# EAGLE design Game of Chairs (EAGLE 6.5.0)
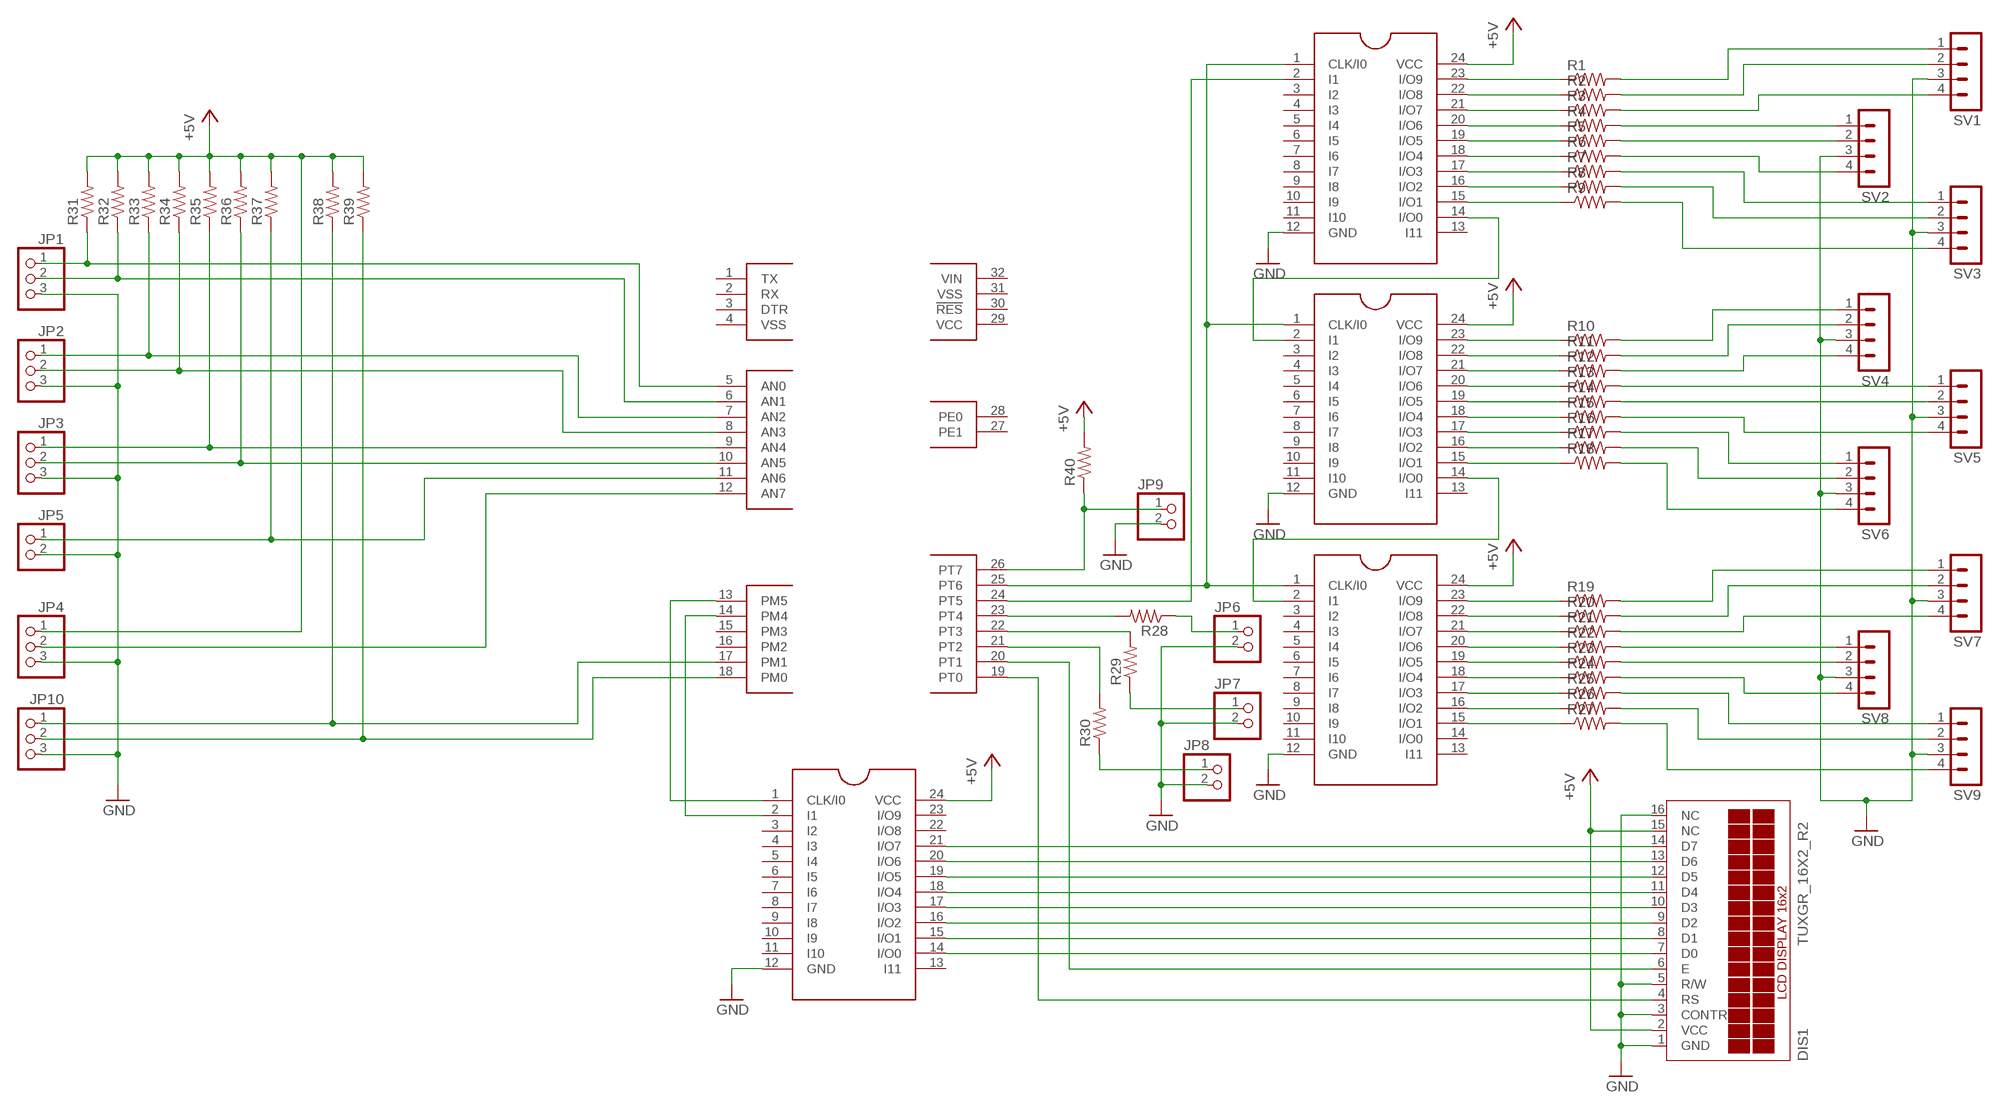
[diagram p0: schematic, sheet 1]

## Parts
DIS1  TUXGR_16X2_R2  [TUXGR_16X2_R2]
GAL1  GAL  [DIL20]
GAL2  GAL  [DIL20]
GAL3  GAL  [DIL20]
GAL4  GAL  [DIL20]
JP1  PINHD-1X3  [1X03]
JP2  PINHD-1X3  [1X03]
JP3  PINHD-1X3  [1X03]
JP4  PINHD-1X3  [1X03]
JP5  PINHD-1X2  [1X02]
JP6  PINHD-1X2  [1X02]
JP7  PINHD-1X2  [1X02]
JP8  PINHD-1X2  [1X02]
JP9  PINHD-1X2  [1X02]
JP10  PINHD-1X3  [1X03]
R1  R-US_0207/12  [0207/12]
R2  R-US_0207/12  [0207/12]
R3  R-US_0207/12  [0207/12]
R4  R-US_0207/12  [0207/12]
R5  R-US_0207/12  [0207/12]
R6  R-US_0207/12  [0207/12]
R7  R-US_0207/12  [0207/12]
R8  R-US_0207/12  [0207/12]
R9  R-US_0207/12  [0207/12]
R10  R-US_0207/12  [0207/12]
R11  R-US_0207/12  [0207/12]
R12  R-US_0207/12  [0207/12]
R13  R-US_0207/12  [0207/12]
R14  R-US_0207/12  [0207/12]
R15  R-US_0207/12  [0207/12]
R16  R-US_0207/12  [0207/12]
R17  R-US_0207/12  [0207/12]
R18  R-US_0207/12  [0207/12]
R19  R-US_0207/12  [0207/12]
R20  R-US_0207/12  [0207/12]
R21  R-US_0207/12  [0207/12]
R22  R-US_0207/12  [0207/12]
R23  R-US_0207/12  [0207/12]
R24  R-US_0207/12  [0207/12]
R25  R-US_0207/12  [0207/12]
R26  R-US_0207/12  [0207/12]
R27  R-US_0207/12  [0207/12]
R28  R-US_0207/12  [0207/12]
R29  R-US_0207/12  [0207/12]
R30  R-US_0207/12  [0207/12]
R31  R-US_0207/12  [0207/12]
R32  R-US_0207/12  [0207/12]
R33  R-US_0207/12  [0207/12]
R34  R-US_0207/12  [0207/12]
R35  R-US_0207/12  [0207/12]
R36  R-US_0207/12  [0207/12]
R37  R-US_0207/12  [0207/12]
R38  R-US_0207/12  [0207/12]
R39  R-US_0207/12  [0207/12]
R40  R-US_0207/12  [0207/12]
SV1  MA04-1  [MA04-1]
SV2  MA04-1  [MA04-1]
SV3  MA04-1  [MA04-1]
SV4  MA04-1  [MA04-1]
SV5  MA04-1  [MA04-1]
SV6  MA04-1  [MA04-1]
SV7  MA04-1  [MA04-1]
SV8  MA04-1  [MA04-1]
SV9  MA04-1  [MA04-1]
U1  362MICRO362MICRO  [40P]

## Nets
+5V: DIS1.2(VCC) DIS1.15(NC) GAL1.24(VCC) GAL2.24(VCC) GAL3.24(VCC) GAL4.24(VCC) JP4.1 R31.2 R32.2 R33.2 R34.2 R35.2 R36.2 R37.2 R38.2 R39.2 R40.2
GND: DIS1.1(GND) DIS1.3(CONTR) DIS1.5(R/W) DIS1.16(NC) GAL1.12(GND) GAL2.12(GND) GAL3.12(GND) GAL4.12(GND) JP1.3 JP2.3 JP3.3 JP4.3 JP5.2 JP6.2 JP7.2 JP8.2 JP9.2 JP10.3 SV1.3 SV2.3 SV3.3 SV4.3 SV5.3 SV6.3 SV7.3 SV8.3 SV9.3
N$1: R1.2 SV1.1
N$2: R2.2 SV1.2
N$3: R3.2 SV1.4
N$4: GAL1.23(I/O9) R1.1
N$5: GAL1.22(I/O8) R2.1
N$6: R6.2 SV2.4
N$7: R7.2 SV3.1
N$8: R8.2 SV3.2
N$9: R9.2 SV3.4
N$10: R10.2 SV4.1
N$11: R11.2 SV4.2
N$12: R12.2 SV4.4
N$13: GAL1.21(I/O7) R3.1
N$14: GAL1.20(I/O6) R4.1
N$15: R15.2 SV5.4
N$16: R16.2 SV6.1
N$17: R17.2 SV6.2
N$18: R18.2 SV6.4
N$19: GAL1.14(I/O0) GAL2.2(I1)
N$20: GAL2.14(I/O0) GAL3.2(I1)
N$21: R19.2 SV7.1
N$22: R20.2 SV7.2
N$23: R21.2 SV7.4
N$24: R4.2 SV2.1
N$25: GAL1.19(I/O5) R5.1
N$26: R24.2 SV8.4
N$27: R25.2 SV9.1
N$28: R26.2 SV9.2
N$29: R27.2 SV9.4
N$30: GAL1.1(CLK/I0) GAL2.1(CLK/I0) GAL3.1(CLK/I0) U1.25(PT6)
N$31: GAL1.2(I1) U1.24(PT5)
N$32: GAL4.1(CLK/I0) U1.13(PM5)
N$33: GAL4.2(I1) U1.14(PM4)
N$34: R5.2 SV2.2
N$35: GAL1.18(I/O4) R6.1
N$36: GAL1.17(I/O3) R7.1
N$37: GAL1.16(I/O2) R8.1
N$38: GAL1.15(I/O1) R9.1
N$39: GAL2.23(I/O9) R10.1
N$40: GAL2.22(I/O8) R11.1
N$41: GAL2.21(I/O7) R12.1
N$42: GAL2.20(I/O6) R13.1
N$43: GAL2.19(I/O5) R14.1
N$44: GAL2.18(I/O4) R15.1
N$45: GAL2.17(I/O3) R16.1
N$46: GAL2.16(I/O2) R17.1
N$47: GAL2.15(I/O1) R18.1
N$48: R14.2 SV5.2
N$49: R13.2 SV5.1
N$50: GAL3.23(I/O9) R19.1
N$51: GAL3.22(I/O8) R20.1
N$52: GAL3.21(I/O7) R21.1
N$53: GAL3.20(I/O6) R22.1
N$54: GAL3.19(I/O5) R23.1
N$55: GAL3.18(I/O4) R24.1
N$56: GAL3.17(I/O3) R25.1
N$57: GAL3.16(I/O2) R26.1
N$58: GAL3.15(I/O1) R27.1
N$59: R23.2 SV8.2
N$60: R22.2 SV8.1
N$61: JP1.1 R31.1 U1.5(AN0)
N$62: JP1.2 R32.1 U1.6(AN1)
N$63: JP2.1 R33.1 U1.7(AN2)
N$64: JP2.2 R34.1 U1.8(AN3)
N$65: JP3.1 R35.1 U1.9(AN4)
N$66: JP3.2 R36.1 U1.10(AN5)
N$67: JP5.1 R37.1 U1.11(AN6)
N$68: JP9.1 R40.1 U1.26(PT7)
N$69: JP10.1 R38.1 U1.17(PM1)
N$70: JP10.2 R39.1 U1.18(PM0)
N$71: JP4.2 U1.12(AN7)
N$72: R28.2 U1.23(PT4)
N$73: JP6.1 R28.1
N$74: R29.2 U1.22(PT3)
N$75: R30.2 U1.21(PT2)
N$76: JP7.1 R29.1
N$77: JP8.1 R30.1
N$78: DIS1.6(E) U1.20(PT1)
N$79: DIS1.4(RS) U1.19(PT0)
N$80: DIS1.7(D0) GAL4.14(I/O0)
N$81: DIS1.8(D1) GAL4.15(I/O1)
N$82: DIS1.9(D2) GAL4.16(I/O2)
N$83: DIS1.10(D3) GAL4.17(I/O3)
N$84: DIS1.11(D4) GAL4.18(I/O4)
N$85: DIS1.12(D5) GAL4.19(I/O5)
N$86: DIS1.13(D6) GAL4.20(I/O6)
N$87: DIS1.14(D7) GAL4.21(I/O7)
Unconnected: GAL1.3(I2) GAL1.4(I3) GAL1.5(I4) GAL1.6(I5) GAL1.7(I6) GAL1.8(I7) GAL1.9(I8) GAL1.10(I9) GAL1.11(I10) GAL1.13(I11) GAL2.3(I2) GAL2.4(I3) GAL2.5(I4) GAL2.6(I5) GAL2.7(I6) GAL2.8(I7) GAL2.9(I8) GAL2.10(I9) GAL2.11(I10) GAL2.13(I11) GAL3.3(I2) GAL3.4(I3) GAL3.5(I4) GAL3.6(I5) GAL3.7(I6) GAL3.8(I7) GAL3.9(I8) GAL3.10(I9) GAL3.11(I10) GAL3.13(I11) GAL3.14(I/O0) GAL4.3(I2) GAL4.4(I3) GAL4.5(I4) GAL4.6(I5) GAL4.7(I6) GAL4.8(I7) GAL4.9(I8) GAL4.10(I9) GAL4.11(I10) GAL4.13(I11) GAL4.22(I/O8) GAL4.23(I/O9) U1.1(TX) U1.2(RX) U1.3(DTR) U1.4(VSS) U1.15(PM3) U1.16(PM2) U1.27(PE1) U1.28(PE0) U1.29(VCC) U1.30(!RES) U1.31(VSS) U1.32(VIN)

## Library data of the parts
DIS1 = display-lcd:TUXGR_16X2_R2: Tuxgraphics LCD display 16x2 characters reflective, without background light Source: tuxgr_12x2_r2.pdf; OC_FARNELL: unknown; OC_NEWARK: unknown
GAL1-GAL4 = 362 parts:GAL
JP1-JP4 JP10 = pinhead:PINHD-1X3: PIN HEADER
JP5-JP9 = pinhead:PINHD-1X2: PIN HEADER
R1-R40 = resistor:R-US_: RESISTOR, American symbol
SV1-SV9 = con-lstb:MA04-1: PIN HEADER; OC_FARNELL: unknown; OC_NEWARK: unknown
U1 = 362 parts:362MICRO

## Board
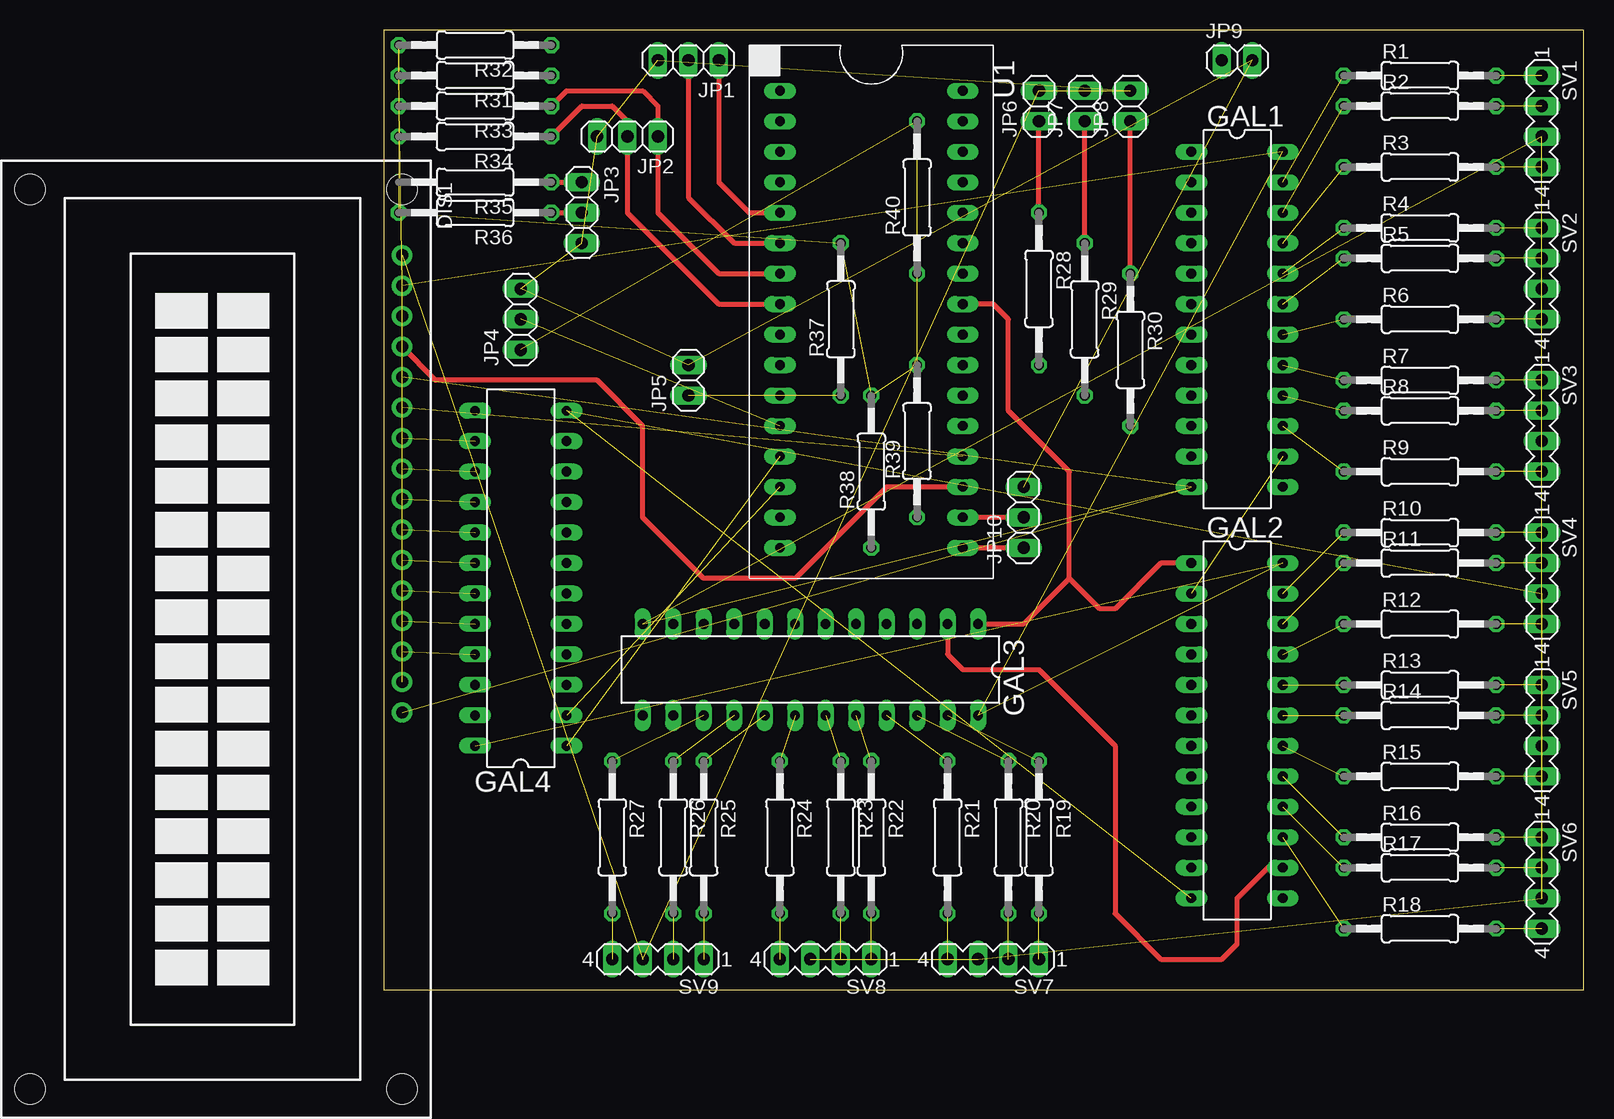
[diagram p1: board, top side]
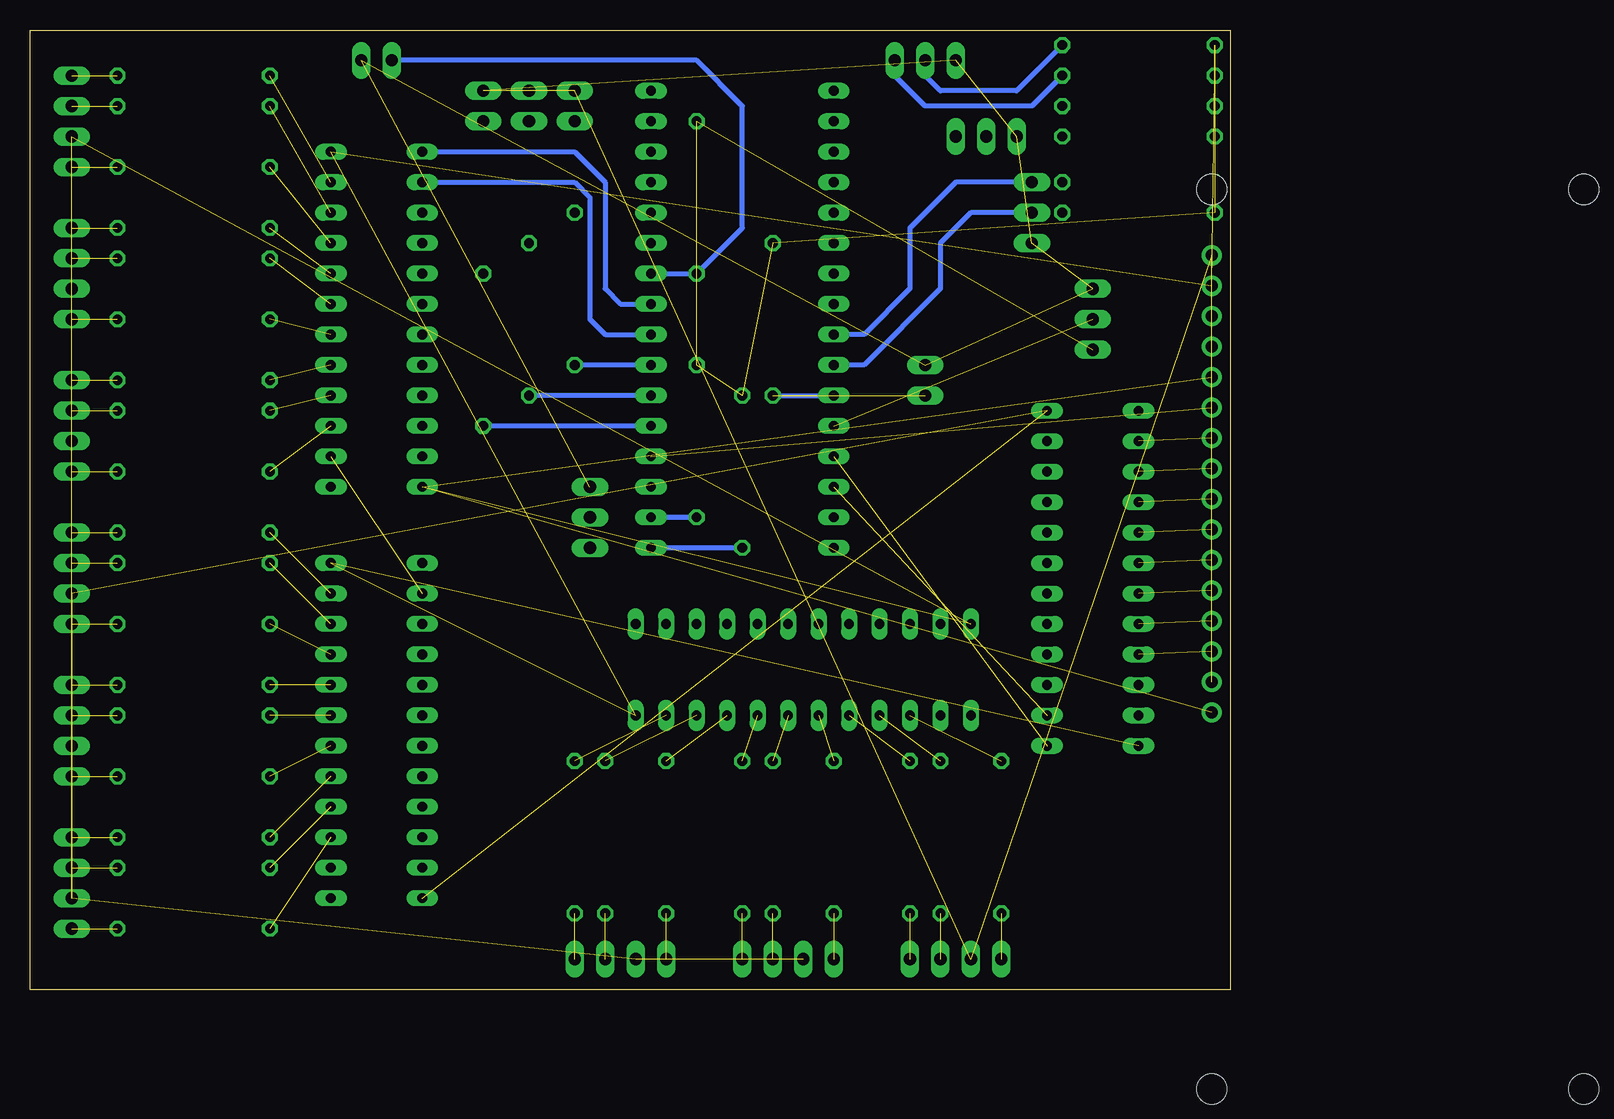
[diagram p2: board, bottom side, seen from below]

Size 100 x 80 mm. Coordinates in mm from the lower left corner, seen from the top.
Outline: 0,0 100,0 100,80 0,80 0,0
Copper layers (1*16): Top 0.035mm / dielectric 1.5mm / Bottom 0.035mm
Design rules "default": minimum track width 10mil, minimum drill 24mil, track to track 8mil, track to pad 8mil, pad to pad 8mil, via to via 8mil, smd to smd 8mil, copper to edge 40mil, drill to drill 8mil, minimum pad ring 10mil, minimum via ring 8mil, stop-mask expansion 4mil, vias tented up to drill 0mil, thermal gap 10mil

### Footprints (pad centres in the part's own frame; a part is rotated, then mirrored left to right if it is on the bottom)
TUXGR_16X2_R2 = drill 1 pad 1.676: 1 -32,15.5; 2 -29.46,15.5; 3 -26.92,15.5; 4 -24.38,15.5; 5 -21.84,15.5; 6 -19.3,15.5; 7 -16.76,15.5; 8 -14.22,15.5; 9 -11.68,15.5; 10 -9.14,15.5; 11 -6.6,15.5; 12 -4.06,15.5; 13 -1.52,15.5; 14 1.02,15.5; 15 3.56,15.5; 16 6.1,15.5 | hole 2.5: -37.5,-15.5; 37.5,-15.5; -37.5,15.5; 37.5,15.5
DIL20 = drill 0.813 long: 1 -11.43,-3.81; 2 -8.89,-3.81; 3 -6.35,-3.81; 4 -3.81,-3.81; 5 -1.27,-3.81; 6 1.27,-3.81; 7 3.81,-3.81; 8 6.35,-3.81; 9 8.89,-3.81; 10 11.43,-3.81; 11 13.97,-3.81; 12 16.51,-3.81; 13 16.51,3.81; 14 13.97,3.81; 15 11.43,3.81; 16 8.89,3.81; 17 6.35,3.81; 18 3.81,3.81; 19 1.27,3.81; 20 -1.27,3.81; 21 -3.81,3.81; 22 -6.35,3.81; 23 -8.89,3.81; 24 -11.43,3.81
1X03 = drill 1.016 long: 1 -2.54,0; 2 0,0; 3 2.54,0
1X02 = drill 1.016 long: 1 -1.27,0; 2 1.27,0
0207/12 = drill 0.813 octagon: 1 -6.35,0; 2 6.35,0
MA04-1 = drill 1.016 long: 1 -3.81,0; 2 -1.27,0; 3 1.27,0; 4 3.81,0
40P = drill 0.813 long: 1 -24.13,-7.62; 2 -21.59,-7.62; 3 -19.05,-7.62; 4 -16.51,-7.62; 5 -13.97,-7.62; 6 -11.43,-7.62; 7 -8.89,-7.62; 8 -6.35,-7.62; 9 -3.81,-7.62; 10 -1.27,-7.62; 11 1.27,-7.62; 12 3.81,-7.62; 13 6.35,-7.62; 14 8.89,-7.62; 15 11.43,-7.62; 16 13.97,-7.62; 17 13.97,7.62; 18 11.43,7.62; 19 8.89,7.62; 20 6.35,7.62; 21 3.81,7.62; 22 1.27,7.62; 23 -1.27,7.62; 24 -3.81,7.62; 25 -6.35,7.62; 26 -8.89,7.62; 27 -11.43,7.62; 28 -13.97,7.62; 29 -16.51,7.62; 30 -19.05,7.62; 31 -21.59,7.62; 32 -24.13,7.62

### Placement (x,y rotation side)
DIS1  -13.97,29.21 270 top
GAL1  71.12,58.42 270 top
GAL2  71.12,24.13 270 top
GAL3  38.1,26.67 180 top
GAL4  11.43,31.75 90 top
JP1  25.4,77.47 180 top
JP2  20.32,71.12 180 top
JP3  16.51,64.77 270 top
JP4  11.43,55.88 90 top
JP5  25.4,50.8 90 top
JP6  54.61,73.66 90 top
JP7  58.42,73.66 90 top
JP8  62.23,73.66 90 top
JP9  71.12,77.47 0 top
JP10  53.34,39.37 90 top
R1  86.36,76.2 0 top
R2  86.36,73.66 0 top
R3  86.36,68.58 0 top
R4  86.36,63.5 0 top
R5  86.36,60.96 0 top
R6  86.36,55.88 0 top
R7  86.36,50.8 0 top
R8  86.36,48.26 0 top
R9  86.36,43.18 0 top
R10  86.36,38.1 0 top
R11  86.36,35.56 0 top
R12  86.36,30.48 0 top
R13  86.36,25.4 0 top
R14  86.36,22.86 0 top
R15  86.36,17.78 0 top
R16  86.36,12.7 0 top
R17  86.36,10.16 0 top
R18  86.36,5.08 0 top
R19  54.61,12.7 270 top
R20  52.07,12.7 270 top
R21  46.99,12.7 270 top
R22  40.64,12.7 270 top
R23  38.1,12.7 270 top
R24  33.02,12.7 270 top
R25  26.67,12.7 270 top
R26  24.13,12.7 270 top
R27  19.05,12.7 270 top
R28  54.61,58.42 270 top
R29  58.42,55.88 270 top
R30  62.23,53.34 270 top
R31  7.62,76.2 180 top
R32  7.62,78.74 180 top
R33  7.62,73.66 180 top
R34  7.62,71.12 180 top
R35  7.62,67.31 180 top
R36  7.62,64.77 180 top
R37  38.1,55.88 90 top
R38  40.64,43.18 90 top
R39  44.45,45.72 90 top
R40  44.45,66.04 90 top
SV1  96.52,72.39 270 top
SV2  96.52,59.69 270 top
SV3  96.52,46.99 270 top
SV4  96.52,34.29 270 top
SV5  96.52,21.59 270 top
SV6  96.52,8.89 270 top
SV7  50.8,2.54 180 top
SV8  36.83,2.54 180 top
SV9  22.86,2.54 180 top
U1  40.64,50.8 270 top

### Tracks (layer width: path | path; a pad name or v marks a point on that pad's centre or on a via)
+5V  (16 unrouted)
GND  (26 unrouted)
N$1  (1 unrouted)
N$2  (1 unrouted)
N$3  (1 unrouted)
N$4  (1 unrouted)
N$5  (1 unrouted)
N$6  (1 unrouted)
N$7  (1 unrouted)
N$8  (1 unrouted)
N$9  (1 unrouted)
N$10  (1 unrouted)
N$11  (1 unrouted)
N$12  (1 unrouted)
N$13  (1 unrouted)
N$14  (1 unrouted)
N$15  (1 unrouted)
N$16  (1 unrouted)
N$17  (1 unrouted)
N$18  (1 unrouted)
N$19  (1 unrouted)
N$20
  Top 0.406: GAL3.2 46.99,27.94 48.26,26.67 54.61,26.67 60.96,20.32 60.96,6.35 64.77,2.54 69.85,2.54 71.12,3.81 71.12,7.62 73.66,10.16 GAL2.14
N$21  (1 unrouted)
N$22  (1 unrouted)
N$23  (1 unrouted)
N$24  (1 unrouted)
N$25  (1 unrouted)
N$26  (1 unrouted)
N$27  (1 unrouted)
N$28  (1 unrouted)
N$29  (1 unrouted)
N$30
  Top 0.406: GAL3.1 53.34,30.48 57.15,34.29 | 57.15,34.29 57.15,43.18 52.07,48.26 52.07,55.88 50.8,57.15 U1.25 | GAL2.1 64.77,35.56 60.96,31.75 59.69,31.75 57.15,34.29
  Bottom 0.406: GAL1.1 54.61,69.85 52.07,67.31 52.07,58.42 50.8,57.15 U1.25
N$31
  Bottom 0.406: GAL1.2 54.61,67.31 53.34,66.04 53.34,55.88 52.07,54.61 U1.24
N$32  (1 unrouted)
N$33  (1 unrouted)
N$34  (1 unrouted)
N$35  (1 unrouted)
N$36  (1 unrouted)
N$37  (1 unrouted)
N$38  (1 unrouted)
N$39  (1 unrouted)
N$40  (1 unrouted)
N$41  (1 unrouted)
N$42  (1 unrouted)
N$43  (1 unrouted)
N$44  (1 unrouted)
N$45  (1 unrouted)
N$46  (1 unrouted)
N$47  (1 unrouted)
N$48  (1 unrouted)
N$49  (1 unrouted)
N$50  (1 unrouted)
N$51  (1 unrouted)
N$52  (1 unrouted)
N$53  (1 unrouted)
N$54  (1 unrouted)
N$55  (1 unrouted)
N$56  (1 unrouted)
N$57  (1 unrouted)
N$58  (1 unrouted)
N$59  (1 unrouted)
N$60  (1 unrouted)
N$61
  Top 0.406: JP1.1 27.94,67.31 30.48,64.77 U1.5
  Bottom 0.406: R31.1 16.51,73.66 25.4,73.66 27.94,76.2 JP1.1
N$62
  Top 0.406: JP1.2 25.4,66.04 29.21,62.23 U1.6
  Bottom 0.406: R32.1 17.78,74.93 24.13,74.93 25.4,76.2 JP1.2
N$63
  Top 0.406: U1.7 27.94,59.69 22.86,64.77 JP2.1 22.86,73.66 21.59,74.93 15.24,74.93 R33.1
N$64
  Top 0.406: U1.8 27.94,57.15 20.32,64.77 JP2.2 20.32,72.39 19.05,73.66 16.51,73.66 R34.1
N$65
  Top 0.406: R35.1 JP3.1
  Bottom 0.406: JP3.1 22.86,67.31 26.67,63.5 26.67,58.42 30.48,54.61 U1.9
N$66
  Top 0.406: R36.1 JP3.2
  Bottom 0.406: JP3.2 21.59,64.77 24.13,62.23 24.13,58.42 30.48,52.07 U1.10
N$67  (1 unrouted)
  Bottom 0.406: R37.1 U1.11
N$68
  Bottom 0.406: U1.26 R40.1 40.64,63.5 40.64,73.66 44.45,77.47 JP9.1
N$69
  Top 0.406: JP10.1 U1.17
  Bottom 0.406: R38.1 U1.17
N$70
  Top 0.406: JP10.2 U1.18
  Bottom 0.406: R39.1 U1.18
N$71  (1 unrouted)
N$72
  Bottom 0.406: U1.23 R28.2
N$73
  Top 0.406: R28.1 JP6.1
N$74
  Bottom 0.406: U1.22 R29.2
N$75
  Bottom 0.406: U1.21 R30.2
N$76
  Top 0.406: R29.1 JP7.1
N$77
  Top 0.406: R30.1 JP8.1
N$78  (1 unrouted)
N$79
  Top 0.406: U1.19 41.91,41.91 34.29,34.29 26.67,34.29 21.59,39.37 21.59,46.99 17.78,50.8 4.32,50.8 DIS1.4
N$80  (1 unrouted)
N$81  (1 unrouted)
N$82  (1 unrouted)
N$83  (1 unrouted)
N$84  (1 unrouted)
N$85  (1 unrouted)
N$86  (1 unrouted)
N$87  (1 unrouted)